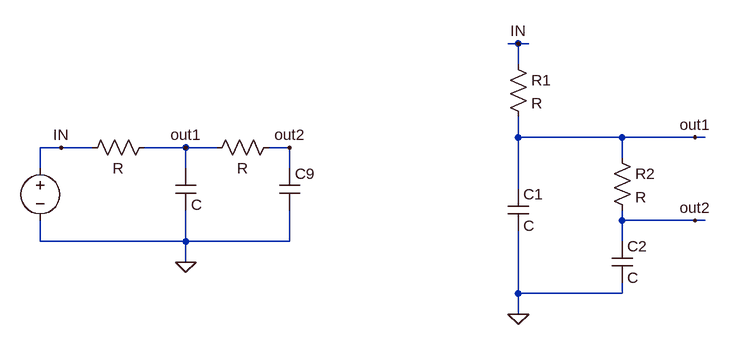
[diagram p0: schematic Draft2 - 副本.asc]
Draft2 - 副本.asc, the LTspice schematic file:
Version 4
SHEET 1 880 1436
WIRE -368 992 -384 992
WIRE -352 992 -368 992
WIRE -368 1024 -368 992
WIRE -368 1136 -368 1104
WIRE -208 1136 -368 1136
WIRE -96 1136 -208 1136
WIRE -80 1136 -96 1136
WIRE -1072 1152 -1104 1152
WIRE -1024 1152 -1072 1152
WIRE -880 1152 -944 1152
WIRE -832 1152 -880 1152
WIRE -720 1152 -752 1152
WIRE -208 1168 -208 1136
WIRE -1104 1184 -1104 1152
WIRE -880 1184 -880 1152
WIRE -720 1184 -720 1152
WIRE -368 1216 -368 1136
WIRE -208 1264 -208 1248
WIRE -96 1264 -208 1264
WIRE -80 1264 -96 1264
WIRE -1104 1296 -1104 1264
WIRE -880 1296 -880 1248
WIRE -880 1296 -1104 1296
WIRE -720 1296 -720 1248
WIRE -720 1296 -880 1296
WIRE -208 1296 -208 1264
WIRE -880 1328 -880 1296
WIRE -368 1376 -368 1280
WIRE -208 1376 -208 1360
WIRE -208 1376 -368 1376
WIRE -368 1408 -368 1376
FLAG -368 1408 0
FLAG -368 992 IN
FLAG -96 1136 out1
FLAG -96 1264 out2
FLAG -880 1328 0
FLAG -1072 1152 IN
FLAG -880 1152 out1
FLAG -720 1152 out2
SYMBOL cap -896 1184 R0
WINDOW 0 24 8 Invisible 2
SYMATTR InstName C8
SYMBOL cap -736 1184 R0
WINDOW 3 24 56 Invisible 2
SYMATTR InstName C9
SYMBOL res -736 1136 R90
WINDOW 0 0 56 Invisible 2
WINDOW 3 32 56 VTop 2
SYMATTR InstName R8
SYMBOL res -928 1136 R90
WINDOW 0 0 56 Invisible 2
WINDOW 3 32 56 VTop 2
SYMATTR InstName R9
SYMBOL voltage -1104 1168 R0
WINDOW 0 24 16 Invisible 2
WINDOW 3 24 96 Invisible 2
SYMATTR InstName V2
SYMBOL res -384 1008 R0
SYMATTR InstName R1
SYMBOL cap -384 1216 R0
SYMATTR InstName C1
SYMBOL res -224 1152 R0
SYMATTR InstName R2
SYMBOL cap -224 1296 R0
SYMATTR InstName C2

The netlist it stands for:
* Draft2 - 副本.asc
C8 out1 0 C
C9 out2 0 C
R8 out2 out1 R
R9 out1 IN R
V2 IN 0 V
R1 IN out1 R
C1 out1 0 C
R2 out1 out2 R
C2 out2 0 C
.backanno
.end